# Altium schematic sheet 6_MCU_Control_Connecter.schdoc
size 297 x 209 mm; Symbol: sucaimuban; Company: 嘉立创EDA; Version: V1.0; Page Size: A4; @Project Name: 26gsSucaiku; @Update Date: 2026-06-26; @Create Date: 2026-06-21; Device: sucaimuban; @Board Name: Sucaiku; @Page Name: MCU_Control_Connecter; @Create Time: 21:33:43; @Page Count: 7; @Page No: 6; @Schematic Name: Schematic1; @Update Time: 14:44:05; @Assembly Variant: Basic; Border: 1; Title Block Position: 3; Size: A4; Width: 1170; Height: 825; Region Start: 1; X Region Count: 6; Y Region Count: 4; Blade Width: 10
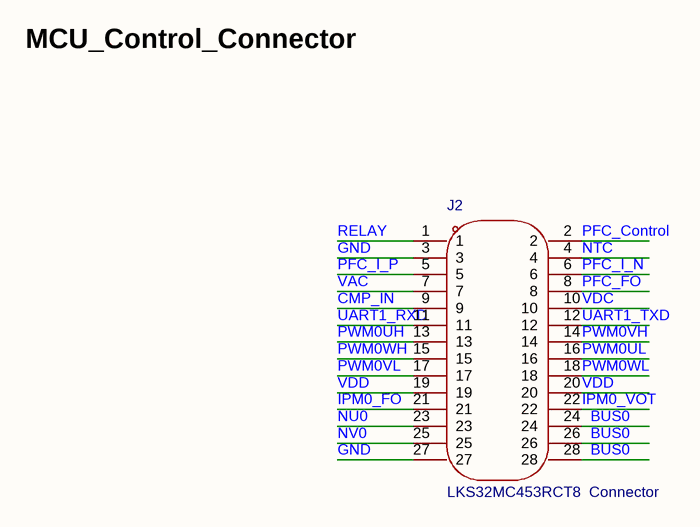
[diagram p0: 6_MCU_Control_Connecter.schdoc]

## Parts
J2  LKS32MC453RCT8  Connector  [HDR-TH_28P-P2.54-V-F-R2-C14-S2.54-1]

## Nets
BUS0: J2.24 J2.26 J2.28
CMP_IN: J2.9
GND: J2.3 J2.27
IPM0_FO: J2.21
IPM0_VOT: J2.22
NTC: J2.4
NU0: J2.23
NV0: J2.25
PFC_Control: J2.2
PFC_FO: J2.8
PFC_I_N: J2.6
PFC_I_P: J2.5
PWM0UH: J2.13
PWM0UL: J2.16
PWM0VH: J2.14
PWM0VL: J2.17
PWM0WH: J2.15
PWM0WL: J2.18
RELAY: J2.1
UART1_RXD: J2.11
UART1_TXD: J2.12
VAC: J2.7
VDC: J2.10
VDD: J2.19 J2.20

## Notes on the sheet
- MCU_Control_Connector
- 身份证号
- 选手姓名
- 手 机 号
- 图页名称
- 第                      幅
- 工程名称
- 共                    幅
- 当前日期
- 当前时间

## Library data of the parts
J2 = DS1023-2*14SF11: 插孔结构:2x14P;间距:2.54mm;行距:2.54mm;安装方式:直插;排数:双排;总孔位数:28P;额定电流:3A;额定电压:600V;插孔方向:顶部;塑高:8.5mm;触头材质:-;触头镀层:金;工作温度:-40℃~+105℃;; Manufacturer: CONNFLY; AddInBom: yes; ModelId: 7a003188d48b46d1b4dfaea3b006a9b7聨0819f05c4eef4c71ace90d822a990e87; ModelName: HDR-TH_28P-P2.54-F-LI-2X14P; ModelTransform: 1419.682,196.85,0,0,0,0,0,0,-118.11; Holes Structure: 2x14P; Pitch: 2.54mm; Number of Positions: 28P; Current Rating: 3A; Voltage Rating (Max): 600V; Holes Direction: 顶部; Symbol: DS1023-2*14SF11; Device: DS1023-2*14SF11; Manufacturer Part: LKS32MC453RCT8  Connector; LCSC Part Name: 2x14P 间距:2.54mm 直插; SupplierPart: C132128; Supplier Footprint: 插件,P=2.54mm; JLCPCB Part Class: Extended Part; Datasheet: https://item.szlcsc.com/datasheet/DS1023-2*14SF11/143427.html; Supplier: LCSC; ConvertToPcb: yes; FootprintName: HDR-TH_28P-P2.54-V-F-R2-C14-S2.54-1; Row Spacing: 2.54mm; Mounting Type: 直插; Number of Rows: 双排; Insulation Height: 8.5mm; Contact Material: -; Contact Plating: 金; Operating Temperature: -40℃~+105℃